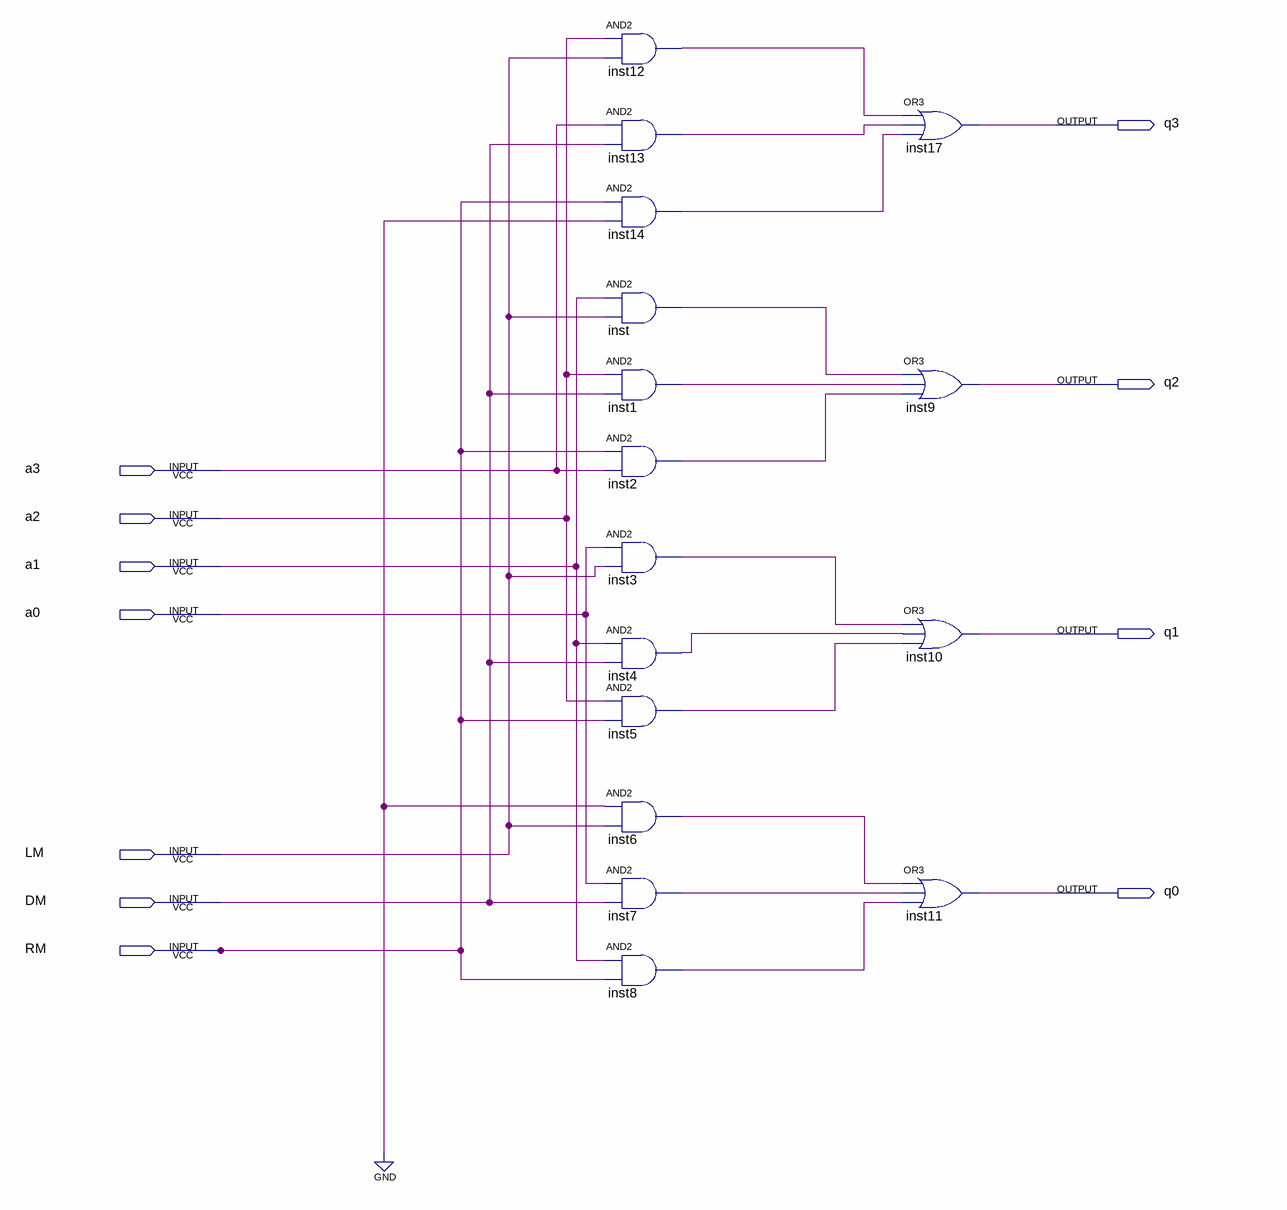
[diagram p0: schematic sheet]
// Quartus schematic 4.bdf as structural Verilog: 16 symbols, 11 pins
module \4  (
  input  a3,
  input  a2,
  input  a1,
  input  a0,
  input  LM,
  input  DM,
  input  RM,
  output q3,
  output q2,
  output q1,
  output q0
);

  wire inst1_out, inst2_out, inst3_out, inst4_out, inst5_out, inst6_out, inst7_out, inst8_out, inst12_out,
       inst13_out, inst14_out, inst_out;

  and inst12 (inst12_out, a2, LM);
  and inst13 (inst13_out, a3, DM);
  and inst14 (inst14_out, RM, 1'b0);
  and inst (inst_out, a1, LM);
  and inst1 (inst1_out, a2, DM);
  and inst2 (inst2_out, RM, a3);
  and inst3 (inst3_out, a0, LM);
  and inst4 (inst4_out, a1, DM);
  and inst5 (inst5_out, a2, RM);
  and inst6 (inst6_out, 1'b0, LM);
  and inst7 (inst7_out, a0, DM);
  and inst8 (inst8_out, a1, RM);
  or inst17 (q3, inst12_out, inst13_out, inst14_out);
  or inst9 (q2, inst_out, inst1_out, inst2_out);
  or inst10 (q1, inst3_out, inst4_out, inst5_out);
  or inst11 (q0, inst6_out, inst7_out, inst8_out);
endmodule
